# Altium schematic sheet [2] Current_Sense.SchDoc
size A4; SheetNumber: 3; SheetTotal: 5
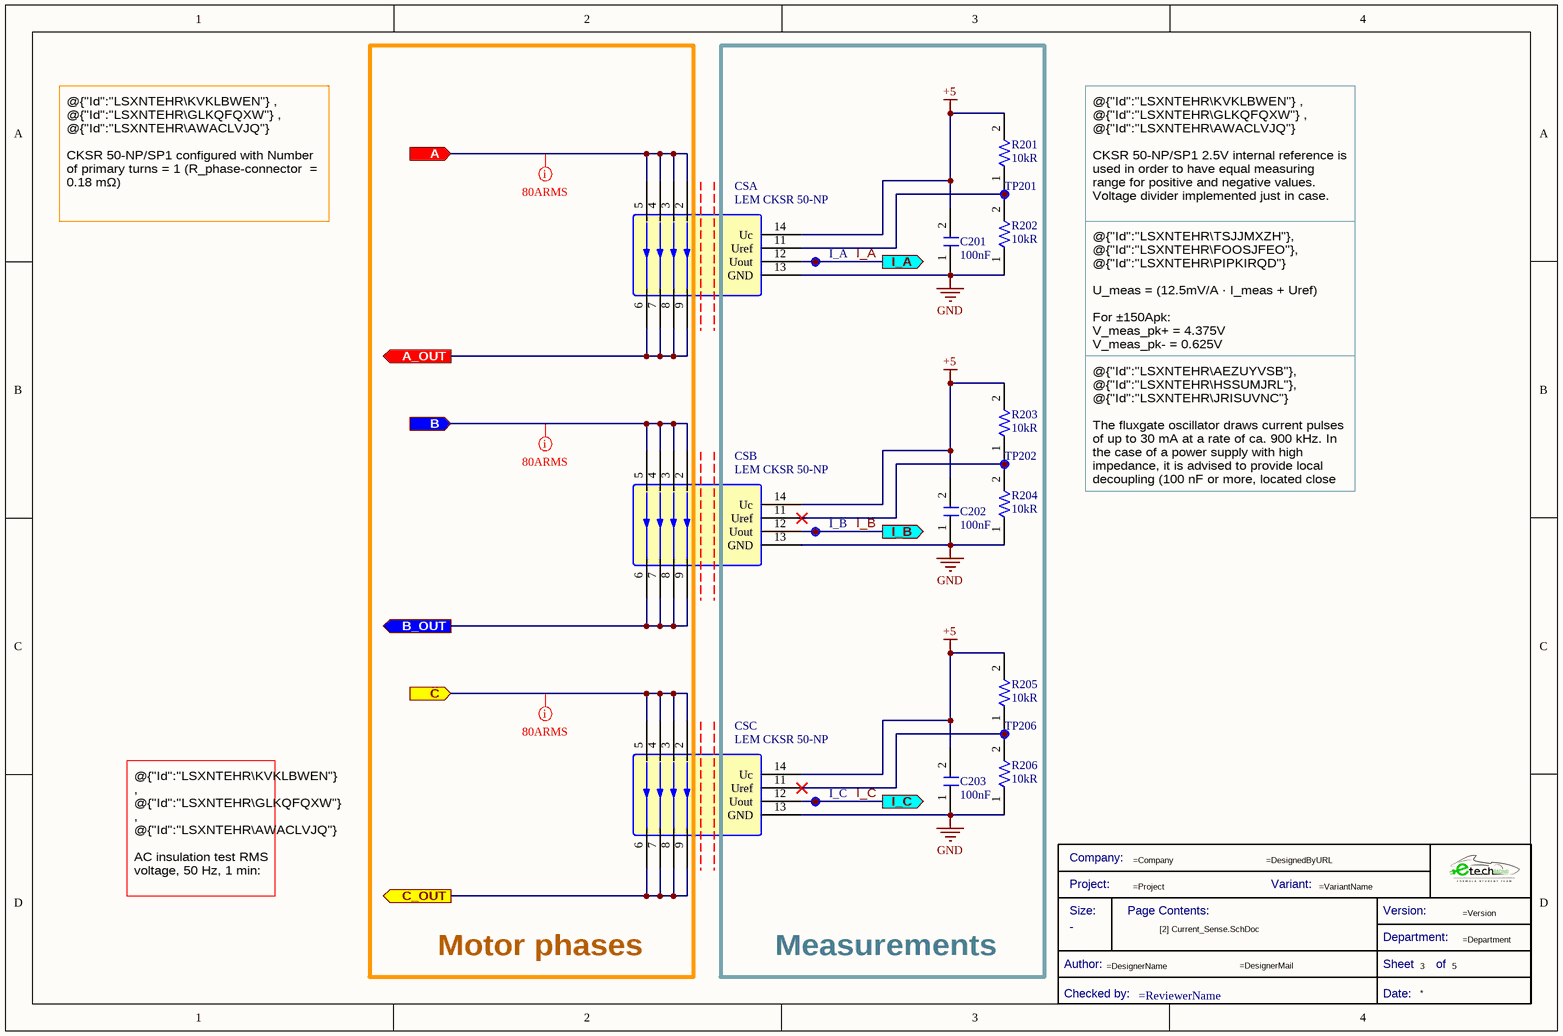
[diagram p0: [2] Current_Sense.SchDoc]

## Parts
*?  Title Block_template  (value not drawn)  (graphical)
C201  Capacitance: 100nF  [C0805FNPC-R]  (hidden comment: 885012207098)
C202  Capacitance: 100nF  [C0805FNPC-R]  (hidden comment: 885012207098)
C203  Capacitance: 100nF  [C0805FNPC-R]  (hidden comment: 885012207098)
CSA  LEM CKSR 50-NP  [CKSR 50-NP]
CSB  LEM CKSR 50-NP  [CKSR 50-NP]
CSC  LEM CKSR 50-NP  [CKSR 50-NP]
I_A  TestPoint  [TestPoint]  (value not drawn)  (no BOM)
I_B  TestPoint  [TestPoint]  (value not drawn)  (no BOM)
I_C  TestPoint  [TestPoint]  (value not drawn)  (no BOM)
R201  Resistance: 10kR  [R0805FTK]  (hidden comment: CR0805-JW-103ELF)
R202  Resistance: 10kR  [R0805FTK]  (hidden comment: CR0805-JW-103ELF)
R203  Resistance: 10kR  [R0805FTK]  (hidden comment: CR0805-JW-103ELF)
R204  Resistance: 10kR  [R0805FTK]  (hidden comment: CR0805-JW-103ELF)
R205  Resistance: 10kR  [R0805FTK]  (hidden comment: CR0805-JW-103ELF)
R206  Resistance: 10kR  [R0805FTK]  (hidden comment: CR0805-JW-103ELF)
TP201  TestPoint  [TestPoint]  (value not drawn)  (no BOM)
TP202  TestPoint  [TestPoint]  (value not drawn)  (no BOM)
TP206  TestPoint  [TestPoint]  (value not drawn)  (no BOM)

## Blocks framed on the sheet
Measurements: C201-C203 I_A I_B I_C R201-R206 TP201 TP202 TP206

## Ports
A (in, see Inverter_Power[4C], [1] Power_Stage[2C]), A_OUT (out, see Inverter_Power[4C]), B (in, see Inverter_Power[4C], [1] Power_Stage[2C]), B_OUT (out, see Inverter_Power[4C]), C (in, see Inverter_Power[4C], [1] Power_Stage[3C]), C_OUT (out, see Inverter_Power[4C]), I_A (out, see Inverter_Power[4C]), I_B (out, see Inverter_Power[4C]), I_C (out, see Inverter_Power[4C])

## Nets
+5: C201.2 C202.2 C203.2 CSA.14(Uc) CSB.14(Uc) CSC.14(Uc) R201.2 R203.2 R205.2
GND: C201.1 C202.1 C203.1 CSA.13(GND) CSB.13(GND) CSC.13(GND) R202.1 R204.1 R206.1
A: CSA.2 CSA.3 CSA.4 CSA.5 ; port A
A_OUT: CSA.6 CSA.7 CSA.8 CSA.9 ; port A_OUT
B: CSB.2 CSB.3 CSB.4 CSB.5 ; port B
B_OUT: CSB.6 CSB.7 CSB.8 CSB.9 ; port B_OUT
C: CSC.2 CSC.3 CSC.4 CSC.5 ; port C
C_OUT: CSC.6 CSC.7 CSC.8 CSC.9 ; port C_OUT
I_A: CSA.12(Uout) I_A.1(TP) ; port I_A
I_B: CSB.12(Uout) I_B.1(TP) ; port I_B
I_C: CSC.12(Uout) I_C.1(TP) ; port I_C
NetCSA_11: CSA.11(Uref) R201.1 R202.2 TP201.1(TP)
NetCSB_11: CSB.11(Uref) R203.1 R204.2 TP202.1(TP)
NetCSC_11: CSC.11(Uref) R205.1 R206.2 TP206.1(TP)

## Layout directives
mark named 80ARMS: A, B, C

## Notes on the sheet
- @{"Id":"LSXNTEHR\KVKLBWEN"} , @{"Id":"LSXNTEHR\GLKQFQXW"} , @{"Id":"LSXNTEHR\AWACLVJQ"}
  CKSR 50-NP/SP1 configured with Number of primary turns = 1 (R_phase-connector  = 0.18 mΩ)
- @{"Id":"LSXNTEHR\KVKLBWEN"} , @{"Id":"LSXNTEHR\GLKQFQXW"} , @{"Id":"LSXNTEHR\AWACLVJQ"}
  CKSR 50-NP/SP1 2.5V internal reference is used in order to have equal measuring range for positive and negative values. Voltage divider implemented just in case.
- @{"Id":"LSXNTEHR\TSJJMXZH"}, @{"Id":"LSXNTEHR\FOOSJFEO"}, @{"Id":"LSXNTEHR\PIPKIRQD"}
  U_meas = (12.5mV/A · I_meas + Uref)
  For ±150Apk:
  V_meas_pk+ = 4.375V
  V_meas_pk- = 0.625V
- @{"Id":"LSXNTEHR\AEZUYVSB"}, @{"Id":"LSXNTEHR\HSSUMJRL"}, @{"Id":"LSXNTEHR\JRISUVNC"}
  The fluxgate oscillator draws current pulses of up to 30 mA at a rate of ca. 900 kHz. In the case of a power supply with high impedance, it is advised to provide local decoupling (100 nF or more, located close to the transducer).
- @{"Id":"LSXNTEHR\KVKLBWEN"} , @{"Id":"LSXNTEHR\GLKQFQXW"} , @{"Id":"LSXNTEHR\AWACLVJQ"}
  AC insulation test RMS voltage, 50 Hz, 1 min:
  Ud = 4.3 kV > 3*V_max = 1.8 kV
- Motor phases
- (in symbol Title Block_template) Company:; Project:; Variant:; Size:; Page Contents:; Version:; Department:; Author:; Sheet; of; Checked by:; Date:

## Library data of the parts
*? = Title Block_template: Standard Title Block; .Creator: GP; Category: Title Block; .PCBcheck: GP; .SCHcheck: GP; Checked by:: =ReviewerName; Size: -
C201-C203 = C100n-50V-0805FNPC-X7R: Cap, 0.1ΜF, 50V, 10%, X7R, 0805; Manufacturer 1: Wurth Electronics; .Creator: DR; Supplier 1: RSComponents; Manufacturer Part Number 1: 885012207098; RoHS: Yes; Category: Ceramic Capacitors; Stock 1: 8000; Pricing 1: 100=0,10200, 500=0,07100, 2000=0,06100 (GBP); Mount: Surface Mount; Case/Package: 0805; Case Code (Metric): 2012; Case Code (Imperial): 0805; Min Operating Temperature: -55°C; Max Operating Temperature: 125°C; Packaging: Cut Tape; Voltage Rating: 50V; Dielectric: X7R; Tolerance: 10%; Voltage Rating (DC): 50V; Length: 0.079inch; Width: 0.049inch; Thickness: 0.035inch; REACH SVHC: Unknown; RoHS Compliant: Yes; ComponentLink1URL: http://www.farnell.com/datasheets/1958498.pdf?src-supplier=Farnell; ComponentLink1Description: http://www.farnell.com/datasheets/1958498.pdf?src-supplier=Farnell; ComponentLink2URL: http://www.farnell.com/datasheets/1958498.pdf?src-supplier=Element14; ComponentLink2Description: http://www.farnell.com/datasheets/1958498.pdf?src-supplier=Element14; ComponentLink3URL: https://katalog.we-online.de/pbs/datasheet/885012207098.pdf?src-supplier=Digi-Key; ComponentLink3Description: https://katalog.we-online.de/pbs/datasheet/885012207098.pdf?src-supplier=Digi-Key; ComponentLink4URL: http://www.farnell.com/datasheets/1958498.pdf?src-supplier=Newark; ComponentLink4Description: http://www.farnell.com/datasheets/1958498.pdf?src-supplier=Newark; Supplier Part Number 1: 1813493
CSA CSB CSC = CKSR 50-NP: Sensor Current Flux 50A AC/DC; Supplier 1: Rs; Manufacturer 1: LEM; Manufacturer Part Number 1: CKSR50-NP; RoHS: Yes; Category: Current Sensors; Stock 1: 84; Pricing 1: 1=15,8, 5=15,33, 10=14,65 (EUR); ComponentLink1URL: https://datasheet.ciiva.com/2812/cksrseries-2812726.pdf?src-supplier=Digi-Key; ComponentLink1Description: https://datasheet.ciiva.com/2812/cksrseries-2812726.pdf?src-supplier=Digi-Key; ComponentLink2URL: https://datasheet.ciiva.com/7992/1639868-7992216.pdf?src-supplier=Element14; ComponentLink2Description: https://datasheet.ciiva.com/7992/1639868-7992216.pdf?src-supplier=Element14; Supplier Part Number 1: 6668214
I_A I_B I_C TP201 TP202 TP206 = TestPoint: Test Point 1x1 mm; .Creator: GP; Category: TestPoint; .PCBcheck: GP; .SCHcheck: GP
R201-R206 = R10k-0805FTK: BOURNS         CR0805-JW-103ELF            Surface Mount Chip Resistor, Thick Film, CR Series, 10 kohm, 125 mW,  5%, 150 V; Temperature Coefficient: 200ppm/°C; Power Rating: 125mW; Voltage Rating: 150V; Voltage Rating (DC): 100V; .Creator: DR; Supplier 1: Arrow Electronics; Manufacturer 1: Bourns; Manufacturer Part Number 1: CR0805-JW-103ELF; RoHS: Yes; Category: Chip SMD Resistors; Stock 1: 57566; Pricing 1: 1=0,05790, 10=0,01540, 25=0,01340, 100=0,00340 (USD); Mount: Surface Mount; Case/Package: 0805; Number of Pins: 2; Contact Plating: Tin; Case Code (Metric): 2012; Case Code (Imperial): 0805; Min Operating Temperature: -55°C; Max Operating Temperature: 155°C; Tolerance: 5%; Resistor Type: Thick Film; Package Quantity: 1; Packaging: Tape and Reel; Number of Terminations: 2; Termination: SMD/SMT; Max Power Dissipation: 125mW; Features: Moisture Resistant; Series: CR0805; Construction: Rectangular; Resistance Tolerance: 5%; Technology: THICK FILM; Length: 2mm; Width: 1.25mm; Height: 0.5mm; Depth: 1.25mm; Thickness: 508um; Radiation Hardening: No; REACH SVHC: No SVHC; Military Standard: Not; RoHS Compliant: Yes; ComponentLink1URL: https://datasheet.ciiva.com/11821/0900766b80fcdb72-11821135.pdf?src-supplier=RSComponents; ComponentLink1Description: https://datasheet.ciiva.com/11821/0900766b80fcdb72-11821135.pdf?src-supplier=RSComponents; ComponentLink2URL: https://datasheet.ciiva.com/9122/chpreztr-9122374.pdf?src-supplier=Avnet; ComponentLink2Description: https://datasheet.ciiva.com/9122/chpreztr-9122374.pdf?src-supplier=Avnet; ComponentLink3URL: https://datasheet.ciiva.com/22693/1902866-22693254.pdf?src-supplier=Element14; ComponentLink3Description: https://datasheet.ciiva.com/22693/1902866-22693254.pdf?src-supplier=Element14; ComponentLink4URL: https://datasheet.ciiva.com/7986/691949-7986187.pdf?src-supplier=Element14; ComponentLink4Description: https://datasheet.ciiva.com/7986/691949-7986187.pdf?src-supplier=Element14; ComponentLink5URL: https://datasheet.ciiva.com/30065/159chpreztr-30065976.pdf?src-supplier=Onlinecomponents.com; ComponentLink5Description: https://datasheet.ciiva.com/30065/159chpreztr-30065976.pdf?src-supplier=Onlinecomponents.com; ComponentLink6URL: https://datasheet.ciiva.com/16783/70154685-16783482.pdf?src-supplier=Allied+Electronics; ComponentLink6Description: https://datasheet.ciiva.com/16783/70154685-16783482.pdf?src-supplier=Allied+Electronics; ComponentLink7URL: https://datasheet.ciiva.com/5548/chpreztr-5548491.pdf?src-supplier=Mouser; ComponentLink7Description: https://datasheet.ciiva.com/5548/chpreztr-5548491.pdf?src-supplier=Mouser; ComponentLink8URL: https://datasheet.ciiva.com/6559/chpreztr-6559900.pdf?src-supplier=Digi-Key; ComponentLink8Description: https://datasheet.ciiva.com/6559/chpreztr-6559900.pdf?src-supplier=Digi-Key; ComponentLink9URL: https://datasheet.ciiva.com/6559/chpreztr-6559901.pdf?src-supplier=Digi-Key; ComponentLink9Description: https://datasheet.ciiva.com/6559/chpreztr-6559901.pdf?src-supplier=Digi-Key; ComponentLink10URL: https://datasheet.ciiva.com/7985/1856384-7985869.pdf?src-supplier=Element14; ComponentLink10Description: https://datasheet.ciiva.com/7985/1856384-7985869.pdf?src-supplier=Element14; ComponentLink11URL: https://datasheet.ciiva.com/48692/001055517-da-01-en-smd-wid-cr0805-jw-103elf-10k-ohm-1-8w-48692118.pdf?src-supplier=Conrad; ComponentLink11Description: https://datasheet.ciiva.com/48692/001055517-da-01-en-smd-wid-cr0805-jw-103elf-10k-ohm-1-8w-48692118.pdf?src-supplier=Conrad; Supplier Part Number 1: CR0805-JW-103ELF